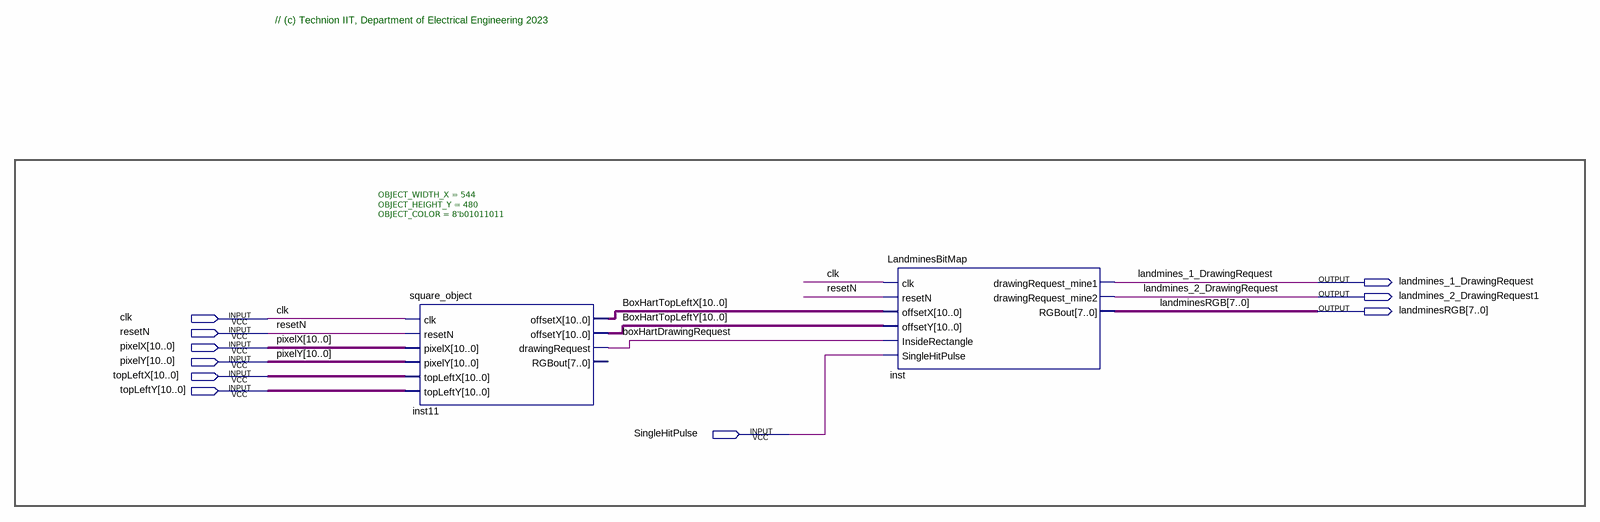
[diagram p0: schematic sheet]
// Quartus schematic LANDMINES_DISPLAY.bdf as structural Verilog: 2 symbols, 10 pins
module LANDMINES_DISPLAY (
  input  clk,
  input  resetN,
  input  [10:0] pixelX,
  input  [10:0] pixelY,
  input  [10:0] topLeftX,
  input  [10:0] topLeftY,
  input  SingleHitPulse,
  output landmines_1_DrawingRequest,
  output landmines_2_DrawingRequest1,
  output [7:0] landminesRGB
);

  wire boxHartDrawingRequest;
  wire [10:0] BoxHartTopLeftX, BoxHartTopLeftY;

  square_object #(.OBJECT_WIDTH_X(544), .OBJECT_HEIGHT_Y(480), .OBJECT_COLOR(8'b01011011)) inst11 (
    .clk(clk), .resetN(resetN), .pixelX(pixelX), .pixelY(pixelY), .topLeftX(topLeftX), .topLeftY(topLeftY),
    .offsetX(BoxHartTopLeftX), .offsetY(BoxHartTopLeftY), .drawingRequest(boxHartDrawingRequest));  // open: RGBout
  LandminesBitMap inst (
    .clk(clk), .resetN(resetN), .offsetX(BoxHartTopLeftX), .offsetY(BoxHartTopLeftY),
    .InsideRectangle(boxHartDrawingRequest), .SingleHitPulse(SingleHitPulse),
    .drawingRequest_mine1(landmines_1_DrawingRequest), .drawingRequest_mine2(landmines_2_DrawingRequest1),
    .RGBout(landminesRGB));

  // Other names for the same wires on the sheet: landmines_2_DrawingRequest = landmines_2_DrawingRequest1

  // Notes on the sheet:
  //   // (c) Technion IIT, Department of Electrical Engineering 2023
endmodule
